# EasyEDA Pro project 10-10.eprj

# Schematic 原理图

## Sheets
1 主控MCU: Board Name: 驱动屏幕; Create Date: 2024-04-22; Page Name: 主控MCU; Project Name: 驱动圆形屏幕; Schematic Name: 原理图; Update Date: 2025-04-11; Company: 嘉立创EDA; Page Size: A3; Version: V1.0
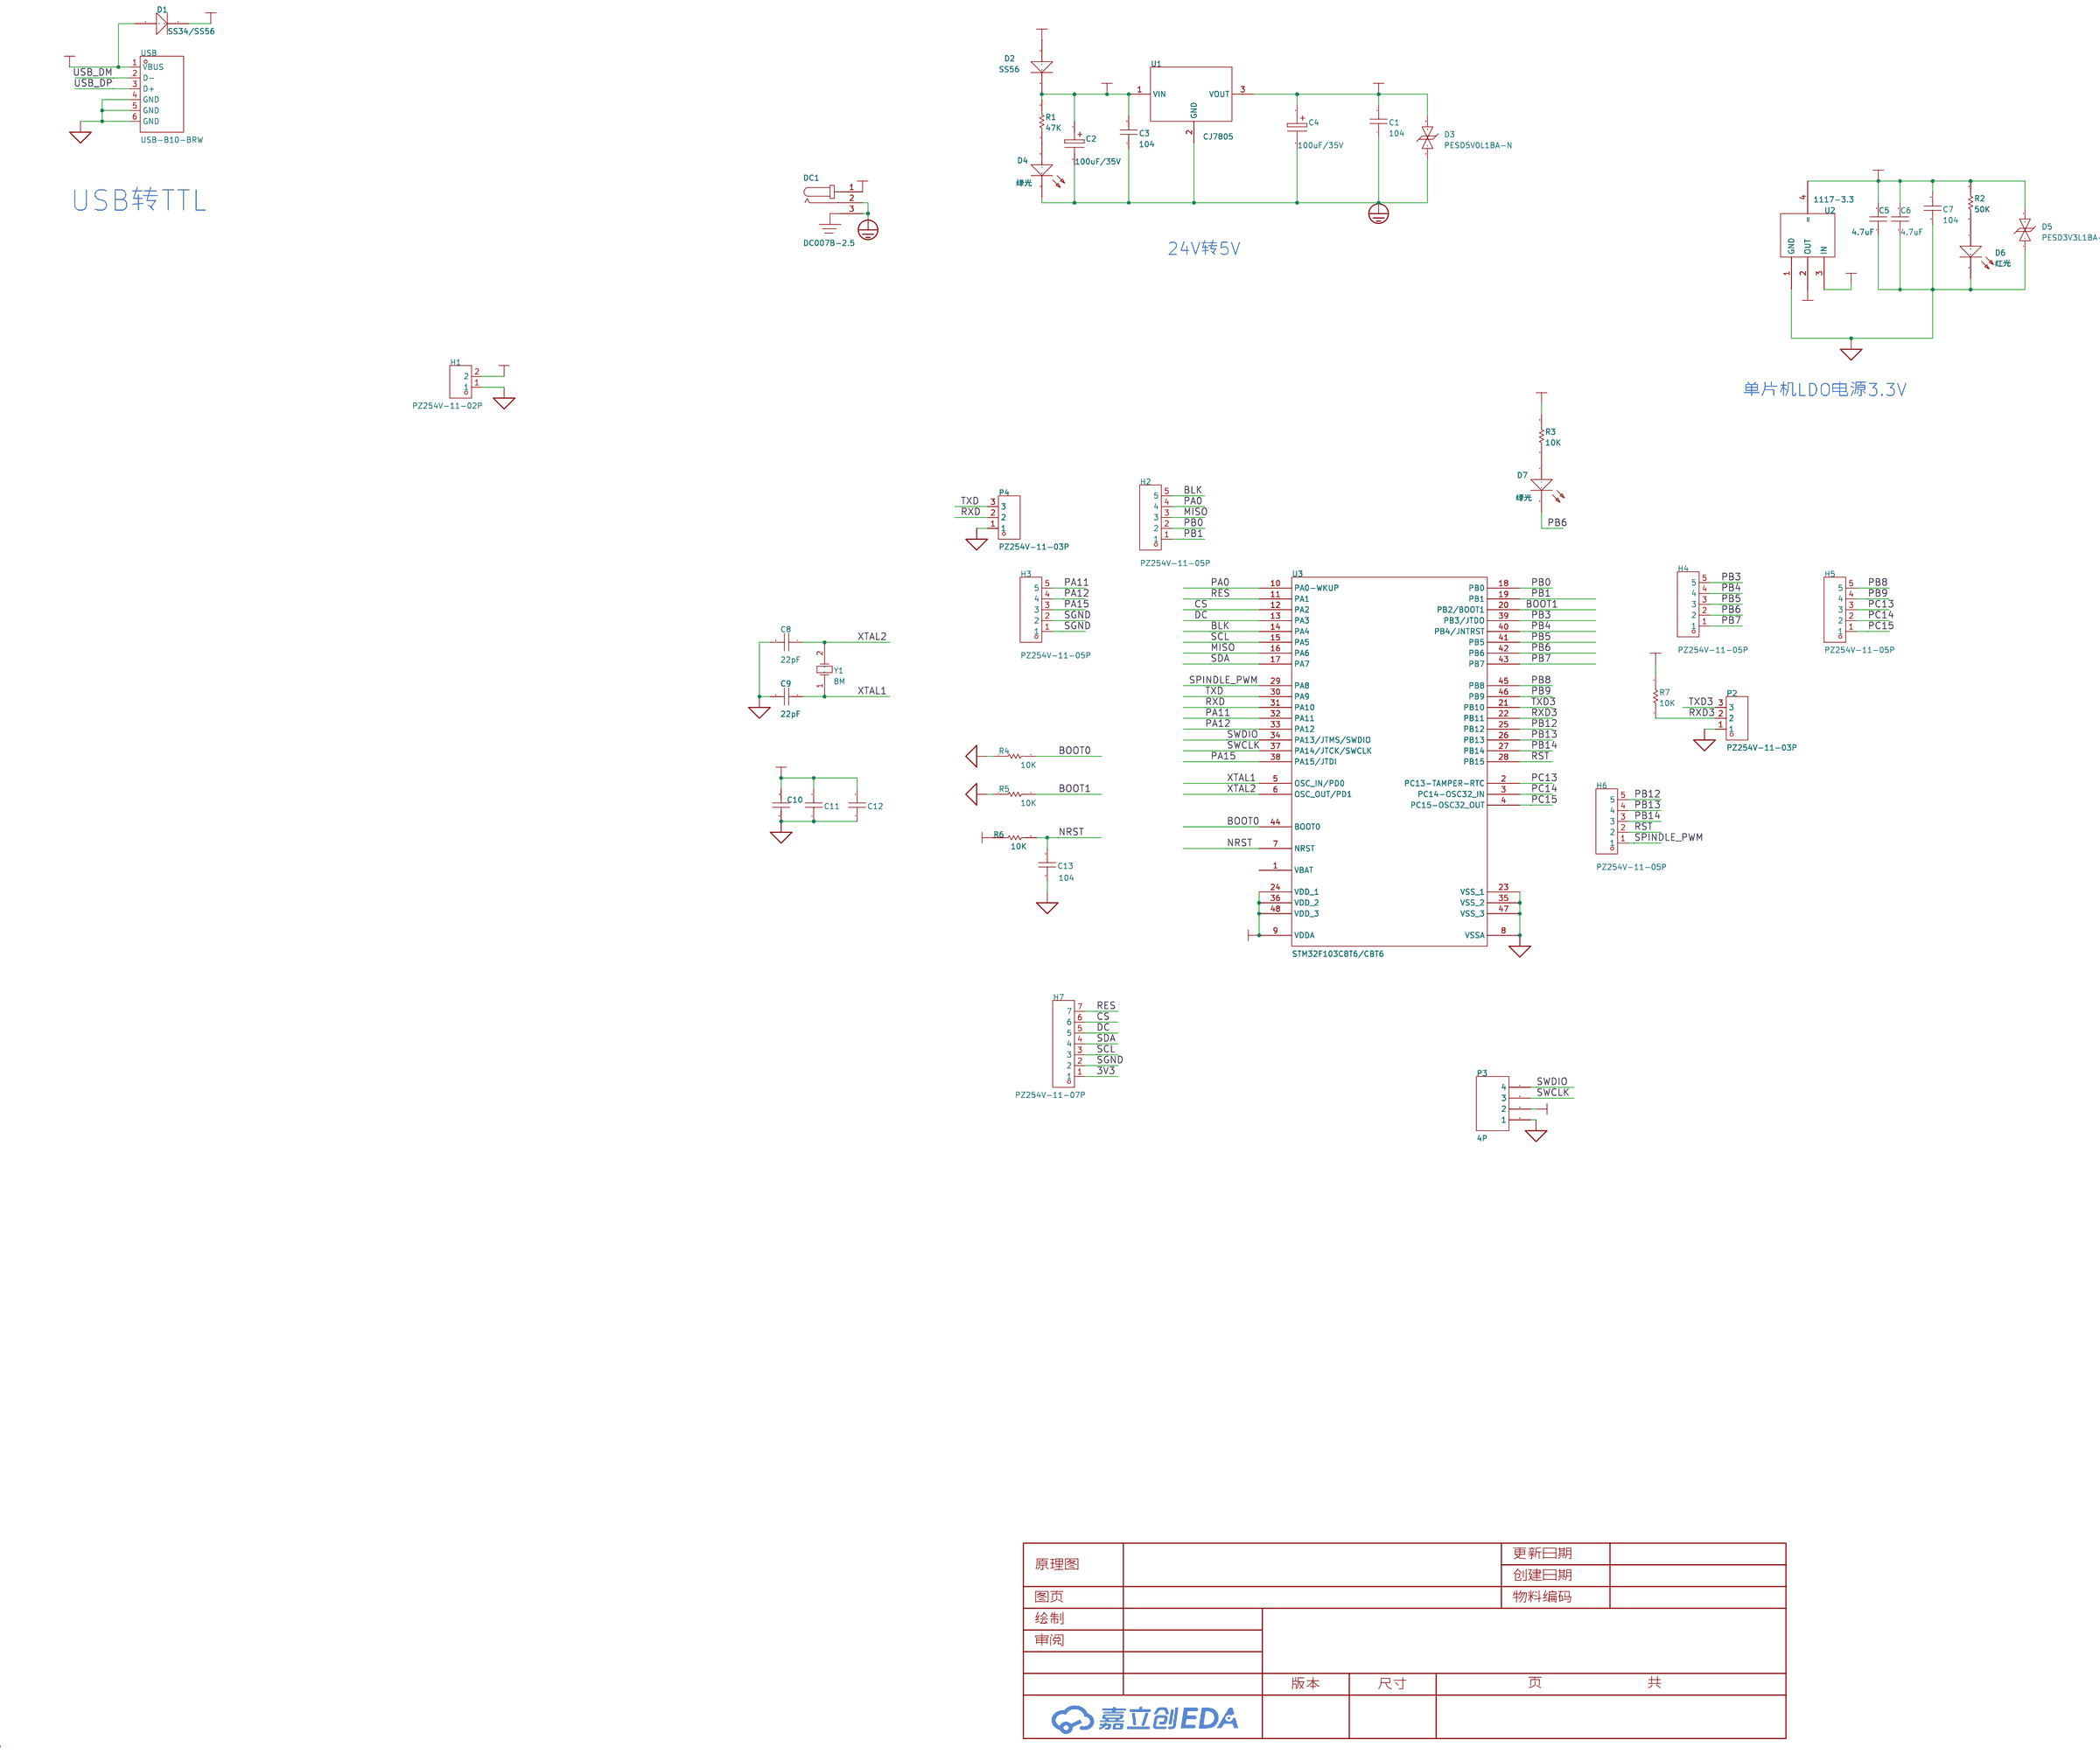
[diagram p0: 主控MCU]
2 电源及控制: Board Name: 转接隔离板; Create Date: 2024-12-30; Page Name: 电源及控制; Project Name: 延时继电器; Update Date: 2025-04-08
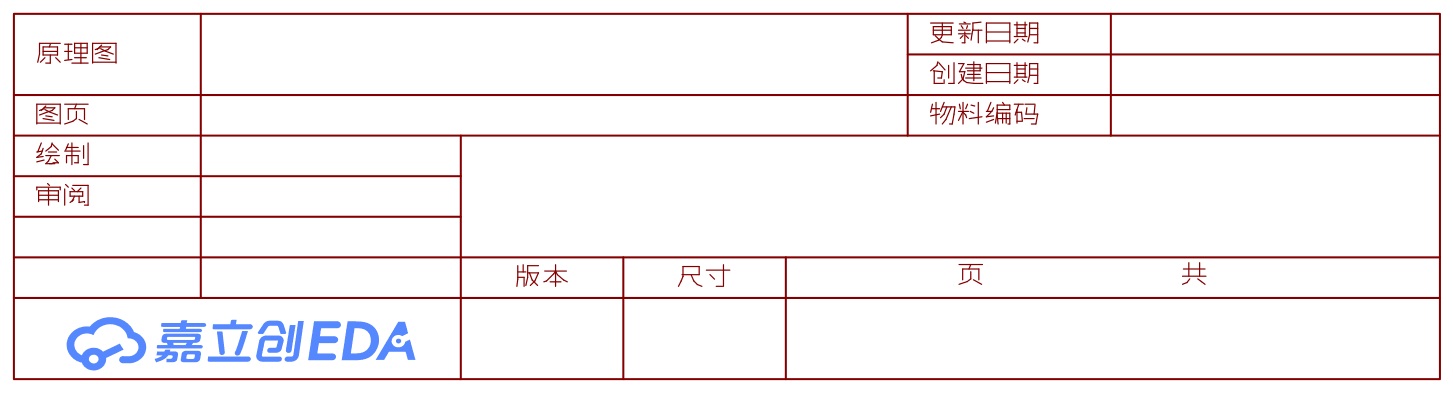
[diagram p1: 电源及控制]

## Parts
C1  104  [0603C]
C2  100uF/35V  [电解电容贴片6X6]
C3  104  [0603C]
C4  100uF/35V  [电解电容贴片6X6]
C5  4.7uF  [C1206]
C6  4.7uF  [C1206]
C7  104  [0603C]
C8  100pF  [0603C]
C9  100pF  [0603C]
C10  104  [0603C]
C11  104  [0603C]
C12  104  [0603C]
C13  104  [0603C]
D1  SS34/SS56  [SMA]
D2  SS56  [SMA]
D3  PESD5V0L1BA-N  [SOD-523_L1.2-W0.8-LS1.6-BI]
D4  绿光  [0603LED]
D5  PESD3V3L1BA-N  [SOD-523_L1.2-W0.8-LS1.6-BI]
D6  红光  [0603LED]
D7  绿光  [0603LED]
DC1  DC007B-2.5  [DC-IN-TH_HX-DC007B-2.5]
H1  PZ254V-11-02P  [HDR-TH_2P-P2.54-V-M]
H2  PZ254V-11-05P  [HDR-TH_5P-P2.54-V-M]
H3  PZ254V-11-05P  [HDR-TH_5P-P2.54-V-M]
H4  PZ254V-11-05P  [HDR-TH_5P-P2.54-V-M]
H5  PZ254V-11-05P  [HDR-TH_5P-P2.54-V-M]
H6  PZ254V-11-05P  [HDR-TH_5P-P2.54-V-M]
H7  PZ254V-11-07P  [HDR-TH_7P-P2.54-V-M]
P2  PZ254V-11-03P  [HDR1X3_CON]
P3  4P  [SIP4]
P4  PZ254V-11-03P  [HDR-TH_3P-P2.54-V-M]
R1  47K  [0603R]
R2  50K  [0603R]
R3  10K  [0603R]
R4  10K  [0603R]
R5  10K  [0603R]
R6  10K  [0603R]
R7  10K  [0603R]
U1  CJ7805  [TO-263-2]
U2  1117-3.3  [SOT-223]
U3  STM32F103C8T6/CBT6  [LQFP48]
USB  USB-B10-BRW  [USB-B-TH_USB-B12-BRW]
Y1  8M  [晶振贴片]

## Library data of the parts
C1 C3 C7 = 104: Capacitor (Semiconductor SIM Model); Published: 8-Jun-2000; LatestRevisionDate: 17-Jul-2002; LatestRevisionNote: Re-released for DXP Platform.; PackageReference: C1206; Publisher: Altium Limited; Origin Footprint 2: C1206; Origin Footprint 3: 0402; Origin Footprint 4: 1310[0504]; Origin Footprint 5: 1608[0603]; Origin Footprint 6: C1210; Origin Footprint 7: C0805; Origin Footprint 8: C1206; Origin Footprint 9: 0805; Origin Footprint 10: 0805L; Design Item ID: Cap Semi; Library Name: Miscellaneous Devices
C2 C4 = 100uF/35V: Origin Footprint 2: X47U; Origin Footprint 1: 电解电容贴片6x6; Design Item ID: ELECTRO1; Library Name: *
C5 C6 = 104: Design Item ID: CAP; Library Name: SCH--װ--
C8 C9 = 22pF: Capacitor (Semiconductor SIM Model); Published: 8-Jun-2000; LatestRevisionDate: 17-Jul-2002; LatestRevisionNote: Re-released for DXP Platform.; PackageReference: C1206; Publisher: Altium Limited; Origin Footprint 2: C1206; Origin Footprint 3: 0402; Origin Footprint 4: 1310[0504]; Origin Footprint 5: 1608[0603]; Origin Footprint 6: C1210; Origin Footprint 7: C0805; Origin Footprint 8: C1206; Origin Footprint 9: 0805; Origin Footprint 10: 0805L; Origin Footprint 11: 0805C; Design Item ID: Cap Semi; Library Name: Miscellaneous Devices
C10-C12 = 104: Origin Footprint 2: CAP; Origin Footprint 3: 0805C; Design Item ID: CAP; Library Name: SCH封装库
C13 = 104: Capacitor (Semiconductor SIM Model); Published: 8-Jun-2000; LatestRevisionDate: 17-Jul-2002; LatestRevisionNote: Re-released for DXP Platform.; PackageReference: C1206; Publisher: Altium Limited; Origin Footprint 2: C1206; Origin Footprint 3: 0402; Origin Footprint 4: 1310[0504]; Origin Footprint 5: 1608[0603]; Origin Footprint 6: C1210; Origin Footprint 7: C0805; Origin Footprint 8: C1206; Origin Footprint 9: 0805; Origin Footprint 10: 0805L; Origin Footprint 11: 0805C; Design Item ID: Cap Semi; Library Name: Miscellaneous Devices
D1 D2 = SS56: Design Item ID: 1N4148; Library Name: SCH封装库
D3 D5 = PESD5V0S1BBN: 极性:Bidirectional;反向关断电压（典型值）:5V (Max);击穿电压（最小值）:6V;箝位电压:15V;峰值脉冲电流（10/1000us）:5A (8/20us);; Supplier Part: C314264; Manufacturer: BORN伯恩半导体; Supplier Footprint: SOD-523; JLCPCB Part Class: Extended Part; Datasheet: https://atta.szlcsc.com/upload/public/pdf/source/20181015/C314264_F9AC5761AC2631DA841FBD1D9C6821E3.pdf; Supplier: LCSC; Polarity: Bidirectional; Voltage - Reverse Standoff (Typ): 5V (Max); Voltage - Breakdown (Min): 6V; Voltage - Clamping (Max) @ Ipp: 15V; Current - Peak Pulse (10/1000μs): 5A (8/20us)
D4 D7 = 绿光: Origin Footprint 2: LED(小); Design Item ID: LED; Library Name: SCH封装库
D6 = 红光: Origin Footprint 2: LED(小); Design Item ID: LED; Library Name: SCH封装库
DC1 = DC007B-2.5: LCSC Part Name: DC电源插座 内径:2.5mm 外径:7.7mm; Supplier Part: C17701685; Manufacturer: SHOU HAN(首韩); Supplier Footprint: 插件; JLCPCB Part Class: 扩展库; Datasheet: https://atta.szlcsc.com/upload/public/pdf/source/20230912/B85EC3863CDA4EDD9FBFF38F4F2C356A.pdf; Supplier: LCSC; Connector Type: DC电源插座; Mounting Type: 弯插; Inside Contact Diameter: 2.5mm; Outside Contact Diameter: 7.7mm; Current Rating: 5A; Voltage Rating (Max): 20V; Operating Temperature: -25℃~+70℃
H1 = PZ254V-11-02P: 插针结构:1x2P;间距:2.54mm;行距:-;圆针/方针:方针;安装类型:直插;排数:单排;总PIN位数:2P;额定电流:-;额定电压:-;配合针长度:6mm;塑高:2.5mm;端接针长度:3mm;触头材质:黄铜;触头镀层:-;工作温度范围:-40℃~+105℃;颜色:黑色;; LCSC Part Name: 间距:2.54mm 1x2P 直插 方针; Supplier Part: C492401; Manufacturer: XFCN(兴飞); Supplier Footprint: 插件,P=2.54mm; JLCPCB Part Class: 扩展库; Datasheet: https://atta.szlcsc.com/upload/public/pdf/source/20200309/C492401_A812433581A9B211A7FFA413ADDFF0E5.pdf; Supplier: LCSC; Pin Structure: 1x2P; Pitch: 2.54mm; Circluar Pins/Square Pins: 方针; Mounting Type: 直插; Number of Rows: 单排; Number of Pins: 2P; Length of Mating Pin: 6mm; Insulation Height: 2.5mm; Length of End Connection Pin: 3mm; Contact Material: 黄铜; Operating Temperature Range: -40℃~+105℃; Color: 黑色
H2-H6 = PZ254V-11-05P: LCSC Part Name: 2.54mm 1x5P 直插 方针; Supplier Part: C492404; Manufacturer: XFCN(兴飞); Supplier Footprint: 直插,P=2.54mm; JLCPCB Part Class: Extended Part; Datasheet: https://atta.szlcsc.com/upload/public/pdf/source/20200309/C492404_E51533260F8710EFF5D4617281164C1D.pdf; Supplier: LCSC; Pitch: 2.54mm; Number of Pins: 5; Number of Rows: 1; Pin Structure: 1x5P; Mounting Type: 直插; Circluar Pins/Square Pins: 方针; Length of Mating Pin: 6mm; Insulation Height: 2.5mm; Length of End Connection Pin: 3mm; Contact Material: 黄铜; Operating Temperature Range: -40℃~+105℃; Color: 黑色
H7 = PZ254V-11-07P: LCSC Part Name: 2.54mm 1x7P 直插 方针; Supplier Part: C492406; Manufacturer: XFCN(兴飞); Supplier Footprint: 直插,P=2.54mm; JLCPCB Part Class: Extended Part; Datasheet: https://atta.szlcsc.com/upload/public/pdf/source/20200309/C492406_654C533EE691117E22DD9F76C114C2D9.pdf; Supplier: LCSC; Pitch: 2.54mm; Number of Pins: 7; Number of Rows: 1; Pin Structure: 1x7P; Mounting Type: 直插; Circluar Pins/Square Pins: 方针; Length of Mating Pin: 6mm; Insulation Height: 2.5mm; Length of End Connection Pin: 3mm; Contact Material: 黄铜; Operating Temperature Range: -40℃~+105℃; Color: 黑色
P2 P4 = PZ254V-11-03P: 插针结构:1x3P;间距:2.54mm;行距:-;圆针/方针:方针;安装类型:直插;排数:单排;总PIN位数:3P;额定电流:3A;额定电压:250V;配合针长度:6mm;塑高:2.5mm;端接针长度:3mm;工作温度范围:-40℃~+105℃;颜色:黑色;; LCSC Part Name: 间距:2.54mm 1x3P 直插 方针; Supplier Part: C2937625; Manufacturer: XFCN(兴飞); Supplier Footprint: 插件,P=2.54mm; JLCPCB Part Class: 扩展库; Datasheet: https://atta.szlcsc.com/upload/public/pdf/source/20200309/C492402_8335C3D49C4E4C618838D59BB1D024C1.pdf; Supplier: LCSC; Pin Structure: 1x3P; Pitch: 2.54mm; Circluar Pins/Square Pins: 方针; Mounting Type: 直插; Number of Rows: 单排; Number of Pins: 3P; Current Rating (Max): 3A; Voltage Rating (Max): 250V; Length of Mating Pin: 6mm; Insulation Height: 2.5mm; Length of End Connection Pin: 3mm; Operating Temperature Range: -40℃~+105℃; Color: 黑色
P3 = 4P: Library Name: SCH--װ--
R1-R3 R7 = 1K: Resistor; Published: 8-Jun-2000; LatestRevisionDate: 17-Jul-2002; LatestRevisionNote: Re-released for DXP Platform.; PackageReference: AXIAL-0.3; Publisher: Altium Limited; Origin Footprint 2: AXIAL-0.3; Origin Footprint 3: R0805; Origin Footprint 4: 0805R; Design Item ID: RES; Library Name: SCH封装库
R4-R6 = 10K: Resistor; Published: 8-Jun-2000; LatestRevisionDate: 17-Jul-2002; LatestRevisionNote: Re-released for DXP Platform.; PackageReference: AXIAL-0.3; Publisher: Altium Limited; Origin Footprint 2: AXIAL-0.3; Origin Footprint 3: 0805R; Origin Footprint 4: 0805R; Design Item ID: RES; Library Name: SCH封装库
U1 = CJ7805: Design Item ID: 7805; Library Name: SCH封装库
U2 = 1117-3.3: Design Item ID: LM1117; Library Name: Party600
U3 = STM32F103C8T6/CBT6: STM32 ARM-based 32-bit MCU with 32 Kbytes Flash, 48-pin LQFP, Industrial Temperature; Published: *; DatasheetVersion: *; PackageVersion: *; PackageReference: *; Publisher: *; PackageDescription: *; ComponentLink1Description: *; ComponentLink1URL: *; ComponentLink2Description: *; ComponentLink2URL: *; Origin Footprint 2: LQFP48_L; Origin Footprint 3: LQFP48_M; Design Item ID: STM32F103C6T6; Library Name: ST Microcontroller 32-Bit STM32 SCH
USB = USB-B10-BRW: 连接器类型:Type-B;标准:USB 2.0;公母:母;端口数量:1;触点数量:4P;安装方式:弯插;额定电流 - 电源:1.5A;工作温度范围:-20℃~+70℃;焊接温度(最大值):260℃;; LCSC Part Name: Type-B母弯插; Supplier Part: C720549; Manufacturer: XUNPU(讯普); Supplier Footprint: 插件; JLCPCB Part Class: 扩展库; Datasheet: https://atta.szlcsc.com/upload/public/pdf/source/20200812/C720549_53E9294752E2933874870440E626C579.pdf; Supplier: LCSC; Connector Type: Type-B; Standard: USB2.0; Gender: 母; Number of Ports: 1; Number of Contacts: 4P; Mounting Style: 弯插; Current Rating - Power (Max): 1.5A; Operating Temperature Range: -20℃~+70℃; Soldering Temperature(Max): 260℃
Y1 = 8M: Crystal Oscillator; Published: 8-Jun-2000; LatestRevisionDate: 17-Jul-2002; LatestRevisionNote: Re-released for DXP Platform.; PackageReference: R38; Publisher: Altium Limited; Origin Footprint 2: R38; Origin Footprint 3: XTAL-49S; Design Item ID: XTAL; Library Name: Miscellaneous Devices

## Nets
3V3: C5.2 C6.2 C7.2 C10.2 C11.2 C12.2 D5.2 H7.1 P3.2 R2.1 R3.2 R6.1 R7.2 U2.2(OUT) U2.4(=) U3.9(VDDA) U3.24(VDD_1) U3.36(VDD_2) U3.48(VDD_3)
5V_VCC: C1.2 C4.1 D1.2 D3.2 H1.2 U1.3(VOUT) U2.3(IN)
24V: D2.1 DC1.1
SGND: C1.1 C2.2 C3.1 C4.2 C5.1 C6.1 C7.1 C8.2 C9.2 C10.1 C11.1 C12.1 C13.1 D3.1 D4.2 D5.1 D6.2 DC1.2 DC1.3 H1.1 H3.1 H3.2 H7.2 P2.1 P3.1 P4.1 R4.1 R5.1 U1.2(GND) U2.1(GND) U3.8(VSSA) U3.23(VSS_1) U3.35(VSS_2) U3.47(VSS_3) USB.4(GND) USB.5(GND) USB.6(GND)
VIN_24V: C2.1 C3.2 D2.2 R1.2 U1.1(VIN)
BLK: H2.5 U3.14(PA4)
BOOT0: R4.2 U3.44(BOOT0)
BOOT1: R5.2 U3.20(PB2/BOOT1)
CS: H7.6 U3.12(PA2)
DC: H7.5 U3.13(PA3)
MISO: H2.3 U3.16(PA6)
NRST: C13.2 R6.2 U3.7(NRST)
PA0: H2.4 U3.10(PA0-WKUP)
PA11: H3.5 U3.32(PA11)
PA12: H3.4 U3.33(PA12)
PA15: H3.3 U3.38(PA15/JTDI)
PB0: H2.2 U3.18(PB0)
PB1: H2.1 U3.19(PB1)
PB3: H4.5 U3.39(PB3/JTDO)
PB4: H4.4 U3.40(PB4/JNTRST)
PB5: H4.3 U3.41(PB5)
PB6: D7.2 H4.2 U3.42(PB6)
PB7: H4.1 U3.43(PB7)
PB8: H5.5 U3.45(PB8)
PB9: H5.4 U3.46(PB9)
PB12: H6.5 U3.25(PB12)
PB13: H6.4 U3.26(PB13)
PB14: H6.3 U3.27(PB14)
PC13: H5.3 U3.2(PC13-TAMPER-RTC)
PC14: H5.2 U3.3(PC14-OSC32_IN)
PC15: H5.1 U3.4(PC15-OSC32_OUT)
RES: H7.7 U3.11(PA1)
RST: H6.2 U3.28(PB15)
RXD: P4.2 U3.31(PA10)
RXD3: P2.2 R7.1 U3.22(PB11)
SCL: H7.3 U3.15(PA5)
SDA: H7.4 U3.17(PA7)
SPINDLE_PWM: H6.1 U3.29(PA8)
SWCLK: P3.3 U3.37(PA14/JTCK/SWCLK)
SWDIO: P3.4 U3.34(PA13/JTMS/SWDIO)
TXD: P4.3 U3.30(PA9)
TXD3: P2.3 U3.21(PB10)
USB_DM: USB.2(D-)
USB_DP: USB.3(D+)
VUSB: D1.1 USB.1(VBUS)
XTAL1: C9.1 U3.5(OSC_IN/PD0) Y1.1(OSC1)
XTAL2: C8.1 U3.6(OSC_OUT/PD1) Y1.2(OSC2)
$1N53807: D7.1 R3.1
$1N55881: D6.1 R2.2
$1N62733: D4.1 R1.1

Not connected (* = marked no-connect by the designer): U3 1(VBAT)

## Notes on the sheets
sheet 1
- USB转TTL
- 24V转5V
- 单片机LDO电源3.3V

# Board PCB
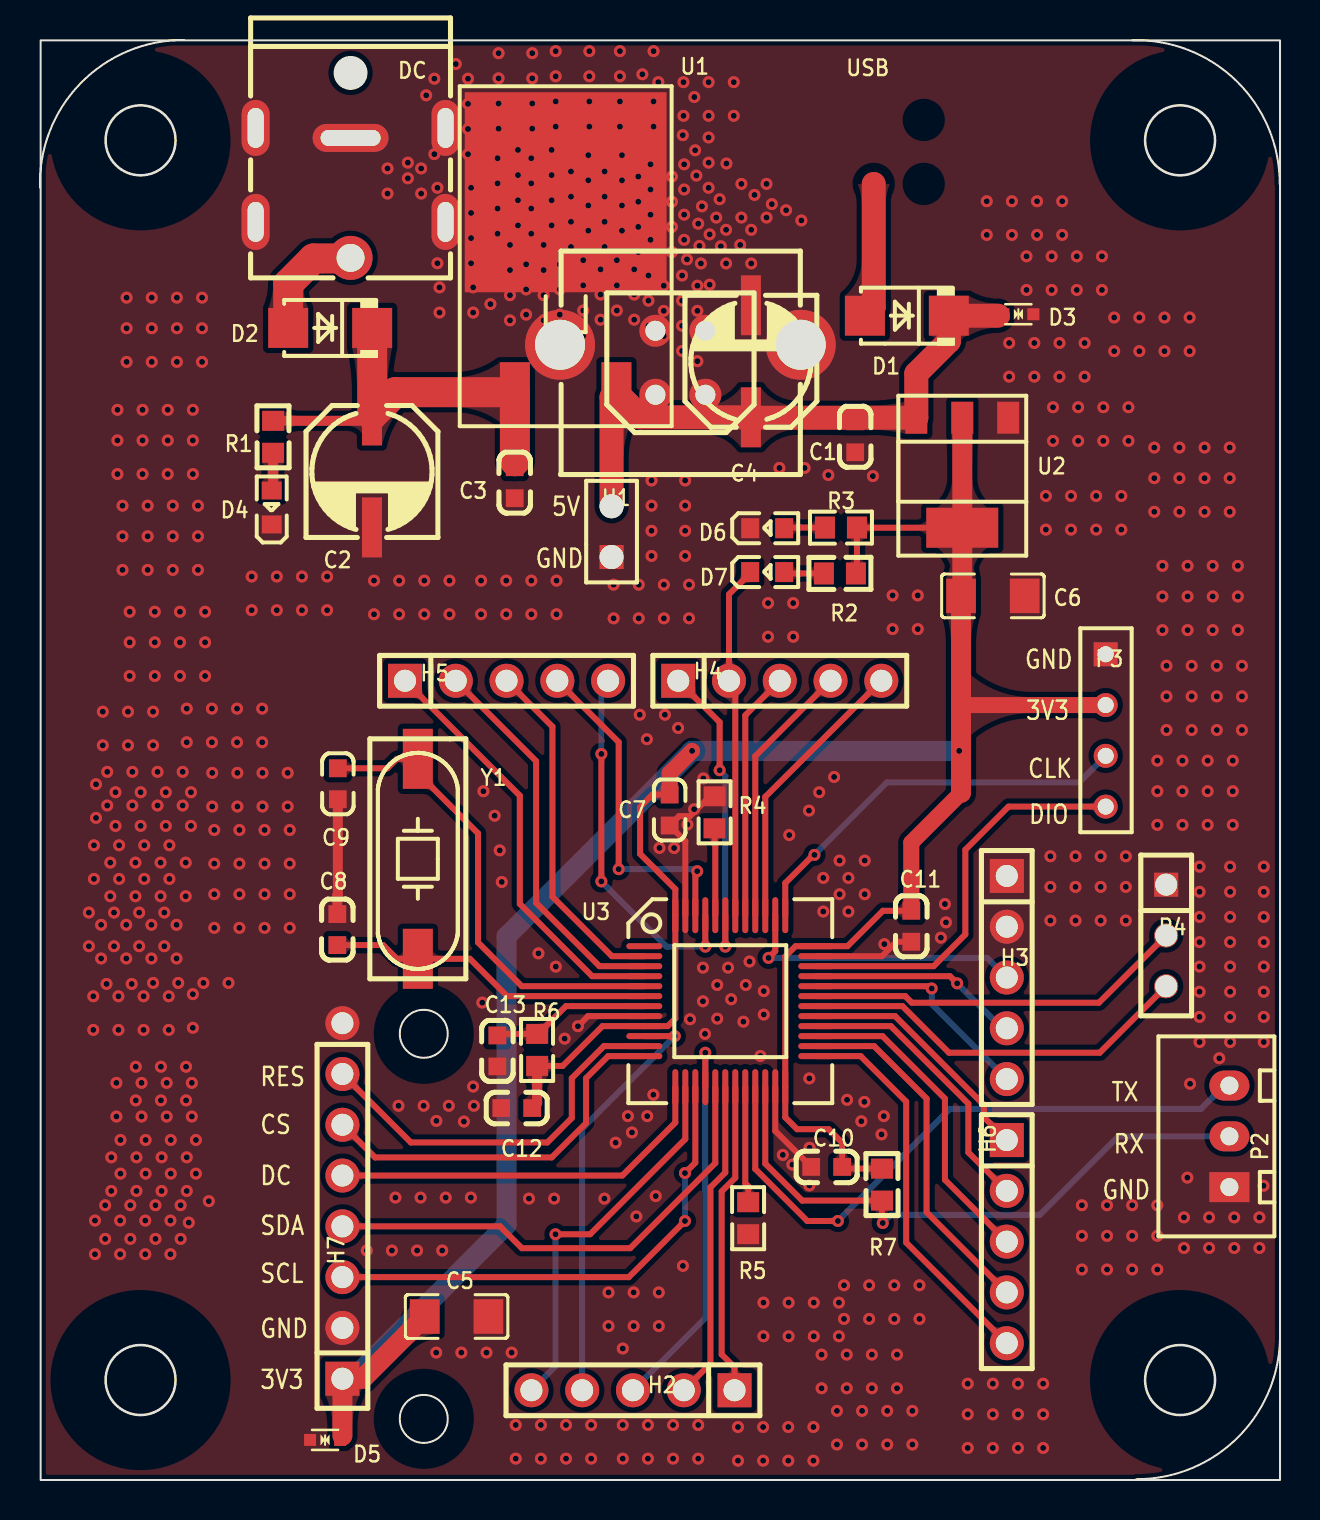
[diagram p2: board, top side]
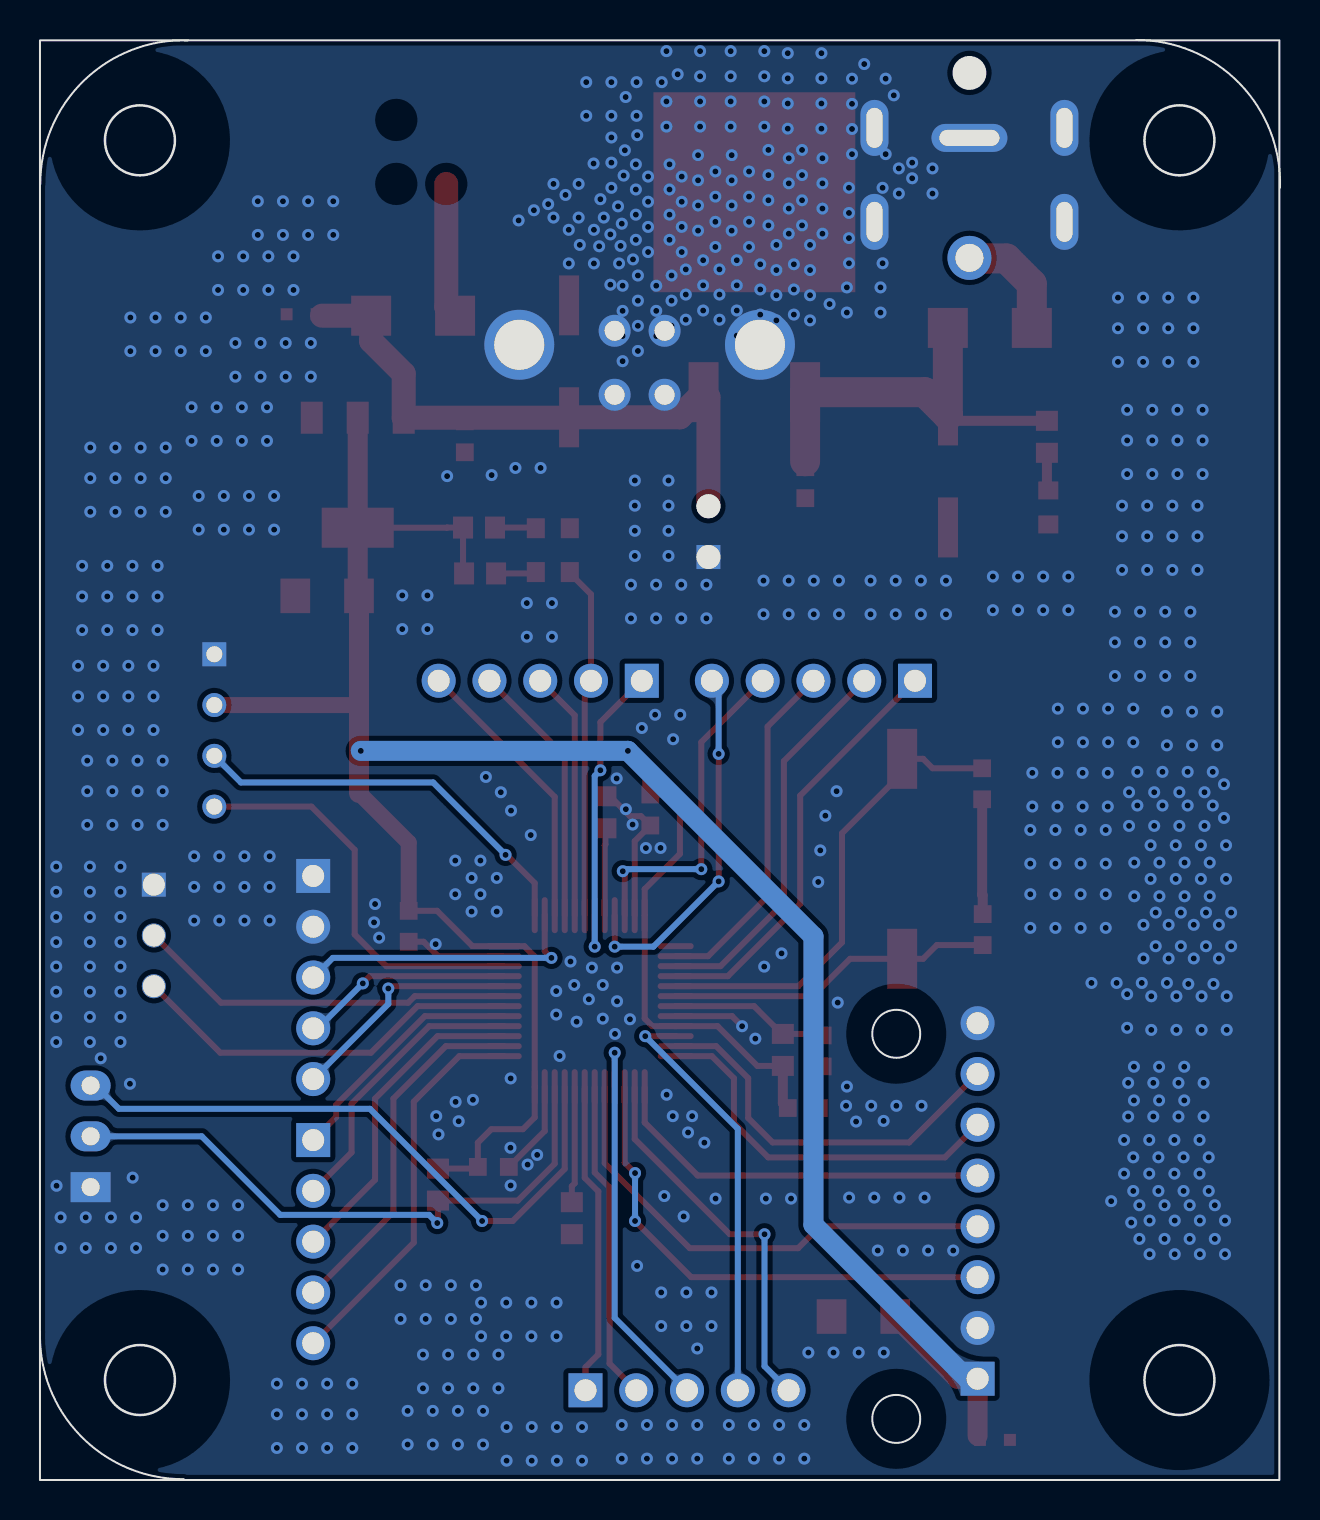
[diagram p3: board, bottom side, seen from below]

Outline 62.03 x 72.02 mm; copper layers: Top Layer, Bottom Layer. Coordinates in mm from the lower left corner of the outline.
Outline path: rectangle 0.03,72 62.03,0 ; circle c5.03,67 r1.75 ; circle c5.03,5 r1.75 ; circle c19.2,22.32 r1.2 ; circle c19.2,3.06 r1.2 ; circle c57.03,67 r1.75 ; circle c57.03,5 r1.75 ; 0,64.64 arc(2.03,69.85) 7.19,72.02 ; 54.64,72 arc(59.85,69.97) 62.02,64.81 ; 62.03,7.42 arc(60,2.21) 54.83,0.04
Stack: Top Layer 0.035mm / Dielectric1 1.51mm FR4 er 4.5 / Bottom Layer 0.035mm

## Design rules (mm)
template: 用户自定义配置
spacing Default (default): track to track 0.152, other pairs 0 to 0.152
track width Default (default): min 0.254, default 0.254, max 25.4
differential pair differentialPair (default): width min 0.127, default 0.254, max 2.54; gap min 0.152, default 0.152
via Default (default): diameter min 0.25, default 0.61, max 100.025; hole min 0.2, default 0.305, max 59.995

## Placement (name value [footprint] x y rotation side)
C1  104  [0603C]  40.78 52.17 90 top
C2  100uF/35V  [电解电容贴片6X6]  16.61 50.44 270 top
C3  104  [0603C]  23.75 49.88 90 top
C4  100uF/35V  [电解电容贴片6X6]  35.56 55.95 90 top
C5  4.7uF  [C1206]  20.84 8.18 180 top
C6  4.7uF  [C1206]  47.67 44.22 180 top
C7  104  [0603C]  31.5 33.51 90 top
C8  100pF  [0603C]  14.87 27.53 90 top
C9  100pF  [0603C]  14.9 34.82 270 top
C10  104  [0603C]  39.35 15.66 0 top
C11  104  [0603C]  43.59 27.69 90 top
C12  104  [0603C]  23.85 18.6 0 top
C13  104  [0603C]  22.88 21.46 90 top
D1  SS34/SS56  [SMA]  43.37 58.23 180 top
D2  SS56  [SMA]  14.52 57.62 180 top
D3  PESD5V0L1BA-N  [SOD-523_L1.2-W0.8-LS1.6-BI]  48.94 58.3 180 top
D4  绿光  [0603LED]  11.61 48.6 270 top
D5  PESD3V3L1BA-N  [SOD-523_L1.2-W0.8-LS1.6-BI]  14.26 2.01 0 top
D6  红光  [0603LED]  36.34 47.58 180 top
D7  绿光  [0603LED]  36.34 45.39 180 top
DC  DC007B-2.5  [DC-IN-TH_HX-DC007B-2.5]  15.54 64.37 270 top
H1  PZ254V-11-02P  [HDR-TH_2P-P2.54-V-M]  28.59 47.43 90 top
H2  PZ254V-11-05P  [HDR-TH_5P-P2.54-V-M]  29.66 4.49 180 top
H3  PZ254V-11-05P  [HDR-TH_5P-P2.54-V-M]  48.36 25.13 270 top
H4  PZ254V-11-05P  [HDR-TH_5P-P2.54-V-M]  37.01 39.97 0 top
H5  PZ254V-11-05P  [HDR-TH_5P-P2.54-V-M]  23.34 39.97 0 top
H6  PZ254V-11-05P  [HDR-TH_5P-P2.54-V-M]  48.36 11.92 270 top
H7  PZ254V-11-07P  [HDR-TH_7P-P2.54-V-M]  15.13 12.69 90 top
NOREF  -  [Pad_e686]  15.13 22.85 0 top
P2  PZ254V-11-03P  [HDR1X3_CON]  59.5 17.19 90 top
P3  4P  [SIP4]  53.31 41.3 270 top
P4  PZ254V-11-03P  [HDR-TH_3P-P2.54-V-M]  56.34 27.23 270 top
R1  47K  [0603R]  11.66 52.17 90 top
R2  50K  [0603R]  40.07 47.63 180 top
R3  10K  [0603R]  40.02 45.34 0 top
R4  10K  [0603R]  33.74 33.39 270 top
R5  10K  [0603R]  35.43 13.09 90 top
R6  10K  [0603R]  24.87 21.51 90 top
R7  10K  [0603R]  42.12 14.77 90 top
U1  CJ7805  [TO-263-2]  26.3 54.4 270 top
U2  1117-3.3  [SOT-223]  46.14 50.43 180 top
U3  STM32F103C8T6/CBT6  [LQFP48]  34.53 23.95 0 top
USB  USB-B10-BRW  [USB-B-TH_USB-B12-BRW]  42.96 66.54 180 top
Y1  8M  [晶振贴片]  18.9 31.07 270 top

## Footprints (pads in the part's own frame, mm; a bottom-side part is the same pattern mirrored in y, then rotated)
0603C
  rect 0.889x0.889 smd: 1(-0.774,0) 2(0.774,0)
0603LED
  rect 0.9x1 smd: 1(-0.884,-0.017) 2(0.816,-0.017)
0603R
  rect 1x1.1 smd: 1(-0.8,0) 2(0.8,0)
C1206
  rect 1.485x1.728 smd: 1(-1.593,0) 2(1.593,0)
DC-IN-TH_HX-DC007B-2.5
  round 2.2 hole 1.4: 1(3.25,0)
  oval 1.4x3.8 hole 0.8x3: 2(-2.75,0)
  oval 2.8x1.4 hole 2x0.8: 3(-3.25,4.75) 3(-3.25,-4.75) 3(1.45,4.75) 3(1.45,-4.75)
HDR1X3_CON
  rect 1.5x2 hole 0.9: 1(-2.54,0)
  oval 1.5x2 hole 0.9: 2(0,0) 3(2.54,0)
HDR-TH_2P-P2.54-V-M
  rect 1.2x1.2 hole 1.2x0.8: 1(-1.27,0)
  round 1.2 hole 1.2x0.8: 2(1.27,0)
HDR-TH_3P-P2.54-V-M
  rect 1.2x1.2 hole 1.1x0.8: 1(-2.54,0)
  round 1.2 hole 1.1x0.8: 2(0,0) 3(2.54,0)
HDR-TH_5P-P2.54-V-M
  rect 1.7x1.7 hole 1.1: 1(-5.08,0)
  round 1.7 hole 1.1: 2(-2.54,0) 3(0,0) 4(2.54,0) 5(5.08,0)
HDR-TH_7P-P2.54-V-M
  rect 1.7x1.7 hole 1.1: 1(-7.62,0)
  round 1.7 hole 1.1: 2(-5.08,0) 3(-2.54,0) 4(0,0) 5(2.54,0) 6(5.08,0) 7(7.62,0)
LQFP48
  oval 1.8x0.3 smd: 1(-4.3,2.75) 2(-4.3,2.25) 3(-4.3,1.75) 4(-4.3,1.25) 5(-4.3,0.75) 6(-4.3,0.25) 7(-4.3,-0.25) 8(-4.3,-0.75) 9(-4.3,-1.25) 10(-4.3,-1.75) 11(-4.3,-2.25) 12(-4.3,-2.75) 25(4.3,-2.75) 26(4.3,-2.25) 27(4.3,-1.75) 28(4.3,-1.25) 29(4.3,-0.75) 30(4.3,-0.25) 31(4.3,0.25) 32(4.3,0.75) 33(4.3,1.25) 34(4.3,1.75) 35(4.3,2.25) 36(4.3,2.75)
  oval 0.3x1.8 smd: 13(-2.75,-4.3) 14(-2.25,-4.3) 15(-1.75,-4.3) 16(-1.25,-4.3) 17(-0.75,-4.3) 18(-0.25,-4.3) 19(0.25,-4.3) 20(0.75,-4.3) 21(1.25,-4.3) 22(1.75,-4.3) 23(2.25,-4.3) 24(2.75,-4.3) 37(2.75,4.3) 38(2.25,4.3) 39(1.75,4.3) 40(1.25,4.3) 41(0.75,4.3) 42(0.25,4.3) 43(-0.25,4.3) 44(-0.75,4.3) 45(-1.25,4.3) 46(-1.75,4.3) 47(-2.25,4.3) 48(-2.75,4.3)
Pad_e686
  round 1.7 hole 1.1: 1(0,0)
SIP4
  rect 1.2x1.2 hole 0.8: 1(0,0)
  round 1.2 hole 0.8: 2(2.54,0) 3(5.08,0) 4(7.62,0)
SMA
  rect 2x2 smd: 1(2.1,0) 2(-2.1,0)
SOD-523_L1.2-W0.8-LS1.6-BI
  rect 0.6x0.6 smd: 1(-0.75,0) 2(0.75,0)
SOT-223
  rect 1.1x1.6 smd: 1(-2.3,-2.7) 2(0,-2.7) 3(2.3,-2.7)
  rect 3.6x2 smd: 4(0,2.8)
TO-263-2
  rect 3x1.5 smd: 1(0,-2.54) 3(0,2.54)
  rect 10x10.1 smd: 2(-10,0)
USB-B-TH_USB-B12-BRW
  round 1.6 hole 1: 1(12.172,12.268) 2(9.672,12.268) 3(9.672,9.068) 4(12.172,9.068)
  round 3.5 hole 2.5: 5(4.902,9.768) 6(16.942,9.768)
晶振贴片
  rect 3x1.5 smd: 1(-5,0) 2(5,0)
电解电容贴片6X6
  rect 3x1 smd: 1(-2.8,0) 2(2.8,0)

## Nets
As in the schematic, except:
24V: D2.1 DC.1
SGND: C1.1 C2.2 C3.1 C4.2 C5.1 C6.1 C7.1 C8.2 C9.2 C10.1 C11.1 C12.1 C13.1 D3.1 D4.2 D5.1 D6.2 DC.2 DC.3 H1.1 H3.1 H3.2 H7.2 NOREF.1 P2.1 P3.1 P4.1 R4.1 R5.1 U1.2 U2.1 U3.8 U3.23 U3.35 U3.47 USB.4 USB.5 USB.6

Pads without a net: U3 1

## Via types
v1: diameter 0.6, hole 0.3, Top Layer to Bottom Layer, 767 vias

## Routing (per net, layer and track width the routed paths; a pad name or vN(x,y) marks a point on that pad's centre or on a via; arc(x,y) is an arc through that point)
3V3: length 148.8
  Top Layer w0.3: C11.2 42.17,28.47 40.4,26.7 38.88,26.7 ; R6.1 26.15,20.71 28.14,22.7 U3.9 31.4,22.7 31.78,23.08 U3.48 31.78,29.55 30.02,31.31 30.02,33.66 30.64,34.28 C7.2 ; U2.4 41.67,47.63 41.67,47.63 R2.1 40.87,45.39 R3.2 ; R7.2 40.21,15.57 C10.2 40.13,16.87 39.45,17.54 37.87,17.54 37.28,18.14 U3.24 37.28,26.18 37.8,26.7 U3.36
  Top Layer w0.5: C12.2 24.87,18.85 R6.1
  Top Layer w0.8: C7.2 31.5,35.34 v1(32.62,36.47) ; 46.07,38.89 46.21,38.76 P3.2 ; C11.2 43.59,31.88 46.07,34.36
  Top Layer w1: C5.2 16.14,5.07 H7.1 15.13,2.21 ; 46.07,34.36 C6.2 46.14,44.28 U2.4 U2.2
  Bottom Layer w1: v1(45.98,36.47) v1(32.62,36.47) 23.34,27.18 23.34,12.77 15.64,5.07 H7.1
5V_VCC: length 29.6
  Top Layer w1.2: H1.2 28.59,54.16 U1.3 29.66,53.58 29.66,53.5 30.02,53.15 C4.1 35.58,53.13 U2.3 43.84,55.33 45.47,56.96 D1.2 47.92,58.23
24V: length 5.9
  Top Layer w1.5: DC.1 15.51,61.09 13.69,61.09 12.42,59.82 D2.1
SGND: length 26.7
  Top Layer w0.3: R4.1 33.51,34.19 32.52,33.2 31.97,33.2 C7.1 32.28,31.95 U3.47 ; 38.88,26.2 42.12,26.2 42.84,26.92 43.59,26.92 ; U3.8 27.41,23.2 v1(26.91,22.7) ; C10.1 36.78,17.45 U3.23
  Top Layer w0.5: C9.2 14.9,29.27 14.87,29.25 C8.2
  vias: v1(2.45,28.38) v1(2.45,26.7) v1(2.7,31.74) v1(2.7,30.06) v1(2.67,24.19) v1(2.67,22.51) v1(2.8,34.8) v1(2.8,33.11) v1(2.75,12.98) v1(2.75,11.29) v1(3.06,27.77) v1(3.06,26.08) v1(3.14,38.43) v1(3.14,36.74) v1(3.26,13.74) v1(3.26,12.06) v1(3.36,35.42) v1(3.36,33.73) v1(3.33,24.81) v1(3.52,30.88) v1(3.52,29.19) v1(3.57,16.14) v1(3.57,14.46) v1(3.7,28.38) v1(3.7,26.7) v1(3.78,34.4) v1(3.78,32.71) v1(3.82,19.86) v1(3.82,18.18) v1(3.87,53.52) v1(3.87,51.99) v1(3.87,50.31) v1(3.92,24.19) v1(3.92,22.51) v1(3.96,31.74) v1(3.96,30.06) v1(4.01,12.98) v1(4.01,11.29) v1(4.03,17.01) v1(4.03,15.32) v1(4.13,48.73) v1(4.13,47.2) v1(4.13,45.52) v1(4.31,27.77) v1(4.31,26.08) v1(4.33,59.13) v1(4.33,57.6) v1(4.33,55.92) v1(4.4,38.43) v1(4.4,36.74) v1(4.48,43.42) v1(4.48,41.89) v1(4.48,40.21) v1(4.52,13.74) v1(4.52,12.06) v1(4.62,35.42) v1(4.62,33.73) v1(4.59,24.81) v1(4.77,30.88) v1(4.77,29.19) v1(4.79,20.67) v1(4.79,18.99) v1(4.83,16.14) v1(4.83,14.46) v1(4.96,28.38) v1(4.96,26.7) v1(5.04,34.4) v1(5.04,32.71) v1(5.08,19.86) v1(5.08,18.18) v1(5.13,53.52) v1(5.13,51.99) v1(5.13,50.31) v1(5.22,31.74) v1(5.22,30.06) v1(5.18,24.19) v1(5.18,22.51) v1(5.28,17.01) v1(5.28,15.32) v1(5.27,12.98) v1(5.27,11.29) v1(5.39,48.73) v1(5.39,47.2) v1(5.39,45.52) v1(5.59,59.13) v1(5.59,57.6) v1(5.59,55.92) v1(5.57,27.77) v1(5.57,26.08) v1(5.66,38.43) v1(5.66,36.74) v1(5.66,24.86) v1(5.74,43.42) v1(5.74,41.89) v1(5.74,40.21) v1(5.78,13.74) v1(5.78,12.06) v1(5.88,35.42) v1(5.88,33.73) v1(6.03,30.88) v1(6.03,29.19) v1(6.05,20.67) v1(6.05,18.99) v1(6.08,16.14) v1(6.08,14.46) v1(6.22,28.38) v1(6.22,26.7) v1(6.29,34.4) v1(6.29,32.71) v1(6.39,53.52) v1(6.39,51.99) v1(6.39,50.31) v1(6.34,19.86) v1(6.34,18.18) v1(6.47,31.74) v1(6.47,30.06) v1(6.44,24.19) v1(6.44,22.51) v1(6.53,12.98) v1(6.53,11.29) v1(6.54,17.01) v1(6.54,15.32) v1(6.64,48.73) v1(6.64,47.2) v1(6.64,45.52) v1(6.85,59.13) v1(6.85,57.6) v1(6.85,55.92) v1(6.83,27.77) v1(6.83,26.08) v1(6.92,24.86) v1(7,43.42) v1(7,41.89) v1(7,40.21) v1(7.03,13.74) v1(7.03,12.06) v1(7.14,35.42) v1(7.14,33.73) v1(7.29,30.88) v1(7.29,29.19) v1(7.31,20.67) v1(7.31,18.99) v1(7.34,38.58) v1(7.34,36.9) v1(7.34,16.14) v1(7.34,14.46) v1(7.44,12.87) v1(7.55,34.4) v1(7.55,32.71) v1(7.6,19.86) v1(7.6,18.18) v1(7.65,53.52) v1(7.65,51.99) v1(7.65,50.31) v1(7.65,24.3) v1(7.65,22.62) v1(7.8,17.01) v1(7.8,15.32) v1(7.9,48.73) v1(7.9,47.2) v1(7.9,45.52) v1(8.11,59.13) v1(8.11,57.6) v1(8.11,55.92) v1(8.17,24.86) v1(8.26,43.42) v1(8.26,41.89) v1(8.26,40.21) v1(8.45,13.95) v1(8.6,38.58) v1(8.6,36.9) v1(8.62,35.37) v1(8.62,33.68) v1(8.72,32.51) v1(8.72,30.83) v1(8.72,29.3) v1(8.72,27.61) v1(9.43,24.86) v1(9.86,38.58) v1(9.86,36.9) v1(9.87,35.37) v1(9.87,33.68) v1(9.98,32.51) v1(9.98,30.83) v1(9.98,29.3) v1(9.98,27.61) v1(10.59,45.18) v1(10.59,43.5) v1(11.12,38.58) v1(11.12,36.9) v1(11.13,35.37) v1(11.13,33.68) v1(11.23,32.51) v1(11.23,30.83) v1(11.23,29.3) v1(11.23,27.61) v1(11.85,45.18) v1(11.85,43.5) v1(12.39,35.37) v1(12.39,33.68) v1(12.49,32.51) v1(12.49,30.83) v1(12.49,29.3) v1(12.49,27.61) v1(13.11,45.18) v1(13.11,43.5) v1(14.36,45.18) v1(14.36,43.5) v1(16.35,11.48) v1(16.71,44.98) v1(16.71,43.3) v1(17.38,65.6) v1(17.38,64.34) v1(17.61,11.48) v1(17.78,14.13) v1(17.97,44.98) v1(17.97,43.3) v1(17.93,18.72) v1(18.4,65.88) v1(18.4,65.1) v1(18.86,11.48) v1(19.07,65.6) v1(19.07,64.34) v1(19.04,14.13) v1(19.23,44.98) v1(19.23,43.3) v1(19.19,18.72) v1(19.32,69.25) v1(19.73,70.08) v1(19.73,66.31) v1(19.82,6.37) v1(19.88,64.63) v1(19.88,60.85) v1(19.83,17.96) v1(19.99,59.64) v1(19.99,58.39) v1(20.12,11.48) v1(20.3,14.13) v1(20.48,44.98) v1(20.48,43.3) v1(20.45,18.72) v1(20.8,70.81) v1(21.08,6.37) v1(21.21,17.93) v1(21.41,70.08) v1(21.41,68.83) v1(21.41,67.57) v1(21.41,66.31) v1(21.56,64.63) v1(21.56,63.37) v1(21.56,62.11) v1(21.56,60.85) v1(21.55,14.13) v1(21.67,59.64) v1(21.67,58.39) v1(21.67,19.68) v1(21.71,18.72) v1(22.06,44.98) v1(22.06,43.3) v1(22.12,23.88) v1(22.18,34.45) v1(22.34,6.37) v1(22.53,58.81) v1(22.74,33.22) v1(22.89,66.11) v1(22.89,64.85) v1(22.89,63.59) v1(22.89,62.33) v1(22.94,71.36) v1(22.94,70.1) v1(22.94,68.84) v1(22.94,67.58) v1(23,31.49) v1(23.1,29.91) v1(23.32,44.98) v1(23.32,43.3) v1(23.51,61.77) v1(23.51,60.51) v1(23.51,59.25) v1(23.51,58) v1(23.59,6.37) v1(23.8,2.75) v1(23.8,1.07) v1(23.91,66.52) v1(23.91,65.26) v1(23.91,64) v1(23.91,62.75) v1(24.32,60.8) v1(24.32,59.54) v1(24.32,58.28) v1(24.46,14.07) v1(24.62,71.36) v1(24.62,70.1) v1(24.62,68.84) v1(24.62,67.58) v1(24.57,66.11) v1(24.57,64.85) v1(24.57,63.59) v1(24.57,62.33) v1(24.58,44.98) v1(24.58,43.3) v1(24.94,26.34) v1(25.06,2.75) v1(25.06,1.07) v1(25.19,61.77) v1(25.19,60.51) v1(25.19,59.25) v1(25.19,58) v1(25.59,66.52) v1(25.59,65.26) v1(25.59,64) v1(25.59,62.75) v1(25.72,14.07) v1(25.8,71.46) v1(25.8,70.2) v1(25.8,68.94) v1(25.8,67.69) v1(25.8,25.68) v1(25.84,44.98) v1(25.84,43.3) v1(26,60.8) v1(26,59.54) v1(26,58.28) v1(26.25,22.07) v1(26.31,2.75) v1(26.31,1.07) v1(26.56,65.44) v1(26.56,64.18) v1(26.56,62.93) v1(26.56,61.67) v1(27.17,61) v1(27.17,59.75) v1(27.17,58.49) v1(27.17,57.23) v1(27.48,71.46) v1(27.48,70.2) v1(27.48,68.94) v1(27.48,67.69) v1(27.43,66.26) v1(27.43,65) v1(27.43,63.74) v1(27.43,62.48) v1(27.57,2.75) v1(27.57,1.07) v1(28.04,60.55) v1(28.04,59.29) v1(28.04,58.03) v1(28.24,65.44) v1(28.24,64.18) v1(28.24,62.93) v1(28.24,61.67) v1(28.23,14.07) v1(28.44,9.38) v1(28.44,7.7) v1(28.69,44.78) v1(28.69,43.09) v1(28.8,16.87) v1(28.86,61) v1(28.86,59.75) v1(28.86,58.49) v1(29.01,71.46) v1(29.01,70.2) v1(29.01,68.94) v1(29.01,67.69) v1(29.11,66.26) v1(29.11,65) v1(29.11,63.74) v1(29.11,62.48) v1(29.15,6.58) v1(29.15,2.75) v1(29.15,1.07) v1(29.41,18.2) v1(29.61,17.38) v1(29.72,60.55) v1(29.72,59.29) v1(29.72,58.03) v1(29.7,9.38) v1(29.7,7.7) v1(29.83,13.18) v1(29.93,65.19) v1(29.93,63.93) v1(29.93,62.67) v1(29.93,61.41) v1(29.95,44.78) v1(29.95,43.09) v1(30,38.27) v1(30.13,70.3) v1(30.36,37.05) v1(30.38,18.2) v1(30.41,2.75) v1(30.41,1.07) v1(30.44,60.24) v1(30.44,58.98) v1(30.44,57.72) v1(30.54,65.8) v1(30.54,64.54) v1(30.54,63.28) v1(30.54,62.02) v1(30.59,49.99) v1(30.59,48.73) v1(30.59,47.47) v1(30.59,46.21) v1(30.69,71.46) v1(30.69,68.94) v1(30.69,67.69) v1(30.68,19.27) v1(30.8,14.2) v1(30.93,69.91) v1(30.99,31.61) v1(30.95,9.38) v1(30.95,7.7) v1(31.2,59.73) v1(31.2,58.47) v1(31.2,57.21) v1(31.21,44.78) v1(31.21,43.09) v1(31.26,38.27) v1(31.61,65.19) v1(31.61,63.93) v1(31.61,62.67) v1(31.61,61.41) v1(31.72,31.61) v1(31.67,2.75) v1(31.67,1.07) v1(31.92,37.61) v1(32.12,60.24) v1(32.12,58.98) v1(32.12,57.72) v1(32.12,56.47) v1(32.19,69.91) v1(32.19,68.23) v1(32.16,67.26) v1(32.22,65.8) v1(32.22,64.54) v1(32.22,63.28) v1(32.22,62.02) v1(32.16,10.71) v1(32.27,49.99) v1(32.27,48.73) v1(32.27,47.47) v1(32.27,46.21) v1(32.37,61.05) v1(32.39,32.78) v1(32.47,44.78) v1(32.47,43.09) v1(32.52,23.04) v1(32.72,33.55) v1(32.73,69.17) v1(32.77,66.5) v1(32.83,65.24) v1(32.89,59.73) v1(32.89,58.47) v1(32.89,57.21) v1(32.89,55.96) v1(32.93,62.83) v1(32.99,61.72) v1(32.93,2.75) v1(32.93,1.07) v1(33.11,63.7) v1(33.06,60.84) v1(33.18,35.09) v1(33.16,25.62) v1(33.16,23.94) v1(33.27,22.31) v1(33.45,69.91) v1(33.45,68.23) v1(33.45,67.14) v1(33.45,65.88) v1(33.45,64.63) v1(33.5,62.3) v1(33.5,59.78) v1(33.83,63.14) v1(33.88,24.76) v1(33.88,23.07) v1(34,64.06) v1(34.06,61.7) v1(34.32,62.53) v1(34.32,60.84) v1(34.34,65.84) v1(34.42,25.62) v1(34.58,24.04) v1(34.7,69.91) v1(34.7,68.23) v1(34.92,2.65) v1(34.92,0.97) v1(35.09,64.82) v1(35.09,63.14) v1(35.03,61.77) v1(35.19,22.92) v1(35.31,24.76) v1(35.49,25.93) v1(35.58,62.53) v1(35.58,60.84) v1(35.74,64.27) v1(36.04,21.21) v1(36.21,24.45) v1(36.21,23.28) v1(36.19,8.87) v1(36.19,7.19) v1(36.17,2.65) v1(36.17,0.97) v1(36.34,64.82) v1(36.34,63.14) v1(36.42,43.86) v1(36.42,42.17) v1(36.61,63.81) v1(36.99,50.62) v1(37.16,16.26) v1(37.32,63.5) v1(37.48,32.25) v1(37.45,8.87) v1(37.45,7.19) v1(37.43,2.65) v1(37.43,0.97) v1(37.68,43.86) v1(37.68,42.17) v1(37.64,15.77) v1(38.09,62.99) v1(38.25,50.62) v1(38.47,33.48) v1(38.49,20.08) v1(38.5,16.62) v1(38.49,14.73) v1(38.71,8.87) v1(38.71,7.19) v1(38.69,2.65) v1(38.69,0.97) v1(38.98,34.4) v1(39.1,6.27) v1(39.1,4.59) v1(39.18,30.11) v1(39.18,28.43) v1(39.44,50.26) v1(39.73,35.16) v1(39.87,3.46) v1(39.87,1.78) v1(40,30.98) v1(40,29.3) v1(39.96,8.87) v1(39.96,7.19) v1(40.22,9.74) v1(40.22,8.06) v1(40.37,19.01) v1(40.36,6.27) v1(40.36,4.59) v1(40.44,30.11) v1(40.44,28.43) v1(41.09,17.94) v1(41.12,3.46) v1(41.12,1.78) v1(41.26,30.98) v1(41.26,29.3) v1(41.24,18.91) v1(41.48,9.74) v1(41.48,8.06) v1(41.61,6.27) v1(41.61,4.59) v1(41.66,50.21) v1(42.1,17.28) v1(42.21,18.2) v1(42.24,26.8) v1(42.38,3.46) v1(42.38,1.78) v1(42.65,44.24) v1(42.65,42.56) v1(42.74,9.74) v1(42.74,8.06) v1(42.87,6.27) v1(42.87,4.59) v1(43.64,3.46) v1(43.64,1.78) v1(43.91,44.24) v1(43.91,42.56) v1(43.99,9.74) v1(43.99,8.06) v1(45.07,27.12) v1(45.27,28.81) v1(45.32,27.89) v1(46.41,4.82) v1(46.41,3.29) v1(46.41,1.6) v1(47.36,63.95) v1(47.36,62.27) v1(47.67,4.82) v1(47.67,3.29) v1(47.67,1.6) v1(48.48,56.86) v1(48.48,55.18) v1(48.62,63.95) v1(48.62,62.27) v1(48.92,4.82) v1(48.92,3.29) v1(48.92,1.6) v1(49.35,61.2) v1(49.35,59.52) v1(49.74,56.86) v1(49.74,55.18) v1(49.88,63.95) v1(49.88,62.27) v1(50.18,4.82) v1(50.18,3.29) v1(50.18,1.6) v1(50.32,49.21) v1(50.32,47.53) v1(50.61,61.2) v1(50.61,59.52) v1(50.54,31.19) v1(50.54,29.66) v1(50.54,27.98) v1(50.68,53.65) v1(50.68,51.97) v1(51,56.86) v1(51,55.18) v1(51.13,63.95) v1(51.13,62.27) v1(51.58,49.21) v1(51.58,47.53) v1(51.8,31.19) v1(51.8,29.66) v1(51.8,27.98) v1(51.87,61.2) v1(51.87,59.52) v1(51.93,53.65) v1(51.93,51.97) v1(52.12,13.74) v1(52.12,12.21) v1(52.12,10.53) v1(52.26,56.86) v1(52.26,55.18) v1(52.83,49.21) v1(52.83,47.53) v1(53.12,61.2) v1(53.12,59.52) v1(53.06,31.19) v1(53.06,29.66) v1(53.06,27.98) v1(53.19,53.65) v1(53.19,51.97) v1(53.38,13.74) v1(53.38,12.21) v1(53.38,10.53) v1(53.74,58.14) v1(53.74,56.46) v1(54.09,49.21) v1(54.09,47.53) v1(54.32,31.19) v1(54.32,29.66) v1(54.32,27.98) v1(54.45,53.65) v1(54.45,51.97) v1(54.64,13.74) v1(54.64,12.21) v1(54.64,10.53) v1(54.99,58.14) v1(54.99,56.46) v1(55.74,51.64) v1(55.74,50.11) v1(55.74,48.42) v1(55.89,35.98) v1(55.89,34.45) v1(55.89,32.76) v1(55.89,13.74) v1(55.89,12.21) v1(55.89,10.53) v1(56.15,45.72) v1(56.15,44.19) v1(56.15,42.51) v1(56.25,58.14) v1(56.25,56.46) v1(56.35,40.72) v1(56.35,39.19) v1(56.35,37.51) v1(57,51.64) v1(57,50.11) v1(57,48.42) v1(57.15,35.98) v1(57.15,34.45) v1(57.15,32.76) v1(57.23,13.13) v1(57.23,11.6) v1(57.41,45.72) v1(57.41,44.19) v1(57.41,42.51) v1(57.4,15.12) v1(57.51,58.14) v1(57.51,56.46) v1(57.61,40.72) v1(57.61,39.19) v1(57.61,37.51) v1(57.53,19.82) v1(58.01,30.68) v1(58.01,29.42) v1(58.01,28.16) v1(58.01,26.9) v1(58.01,25.68) v1(58.01,24.42) v1(58.01,23.16) v1(58.01,21.9) v1(58.26,51.64) v1(58.26,50.11) v1(58.26,48.42) v1(58.41,35.98) v1(58.41,34.45) v1(58.41,32.76) v1(58.48,13.13) v1(58.48,11.6) v1(58.66,45.72) v1(58.66,44.19) v1(58.66,42.51) v1(58.87,40.72) v1(58.87,39.19) v1(58.87,37.51) v1(58.99,21.09) v1(59.51,51.64) v1(59.51,50.11) v1(59.51,48.42) v1(59.54,30.68) v1(59.54,29.42) v1(59.54,28.16) v1(59.54,26.9) v1(59.54,25.68) v1(59.54,24.42) v1(59.54,23.16) v1(59.54,21.9) v1(59.67,35.98) v1(59.67,34.45) v1(59.67,32.76) v1(59.74,13.13) v1(59.74,11.6) v1(59.92,45.72) v1(59.92,44.19) v1(59.92,42.51) v1(60.13,40.72) v1(60.13,39.19) v1(60.13,37.51) v1(61,13.13) v1(61,11.6) v1(61.22,30.68) v1(61.22,29.42) v1(61.22,28.16) v1(61.22,26.9) v1(61.22,25.68) v1(61.22,24.42) v1(61.22,23.16) v1(61.22,21.9) v1(61.2,14.72)
VIN_24V: length 20.1
  Top Layer w0.5: R1.2 16.34,52.97
  Top Layer w1.5: 16.62,53.25 C2.1 ; 16.62,53.25 17.77,54.4 U1.1 23.76,50.95 ; 16.62,53.25 D2.2
BLK: length 19.4
  Top Layer w0.3: U3.14 32.28,17.05 27.52,12.29 v1(25.79,12.29)
  Bottom Layer w0.3: v1(25.79,12.29) 25.79,5.69 H2.5
BOOT0: length 4.4
  Top Layer w0.3: U3.44 33.78,31.75 33.74,31.79 R4.2
BOOT1: length 5.8
  Top Layer w0.3: U3.20 35.28,14.84 35.43,14.69 R5.2
CS: length 19.2
  Top Layer w0.3: H7.6 16.76,16.13 25.6,16.13 27.32,17.85 27.32,20.09 28.42,21.2 U3.12
DC: length 19.5
  Top Layer w0.3: H7.5 29.13,15.23 31.78,17.88 U3.13
MISO: length 20.1
  Top Layer w0.3: U3.16 v1(33.28,21.37)
  Bottom Layer w0.3: H2.3 33.28,8.11 v1(33.28,21.37)
NRST: length 8
  Top Layer w0.3: C13.2 22.96,22.31 R6.2 24.92,22.31 26.31,23.7 U3.7
PA0: length 21.2
  Top Layer w0.3: U3.10 v1(31.75,22.2)
  Bottom Layer w0.3: H2.4 27.12,17.57 v1(31.75,22.2)
PA11: length 11.9
  Top Layer w0.3: U3.32 44.49,24.7 v1(44.61,24.58)
  Bottom Layer w0.3: H3.5 44.61,23.81 v1(44.61,24.58)
PA12: length 10.6
  Top Layer w0.3: v1(45.88,24.84) 45.52,25.2 U3.33
  Bottom Layer w0.3: v1(45.88,24.84) 48.13,22.59 H3.4
PA15: length 14.6
  Top Layer w0.3: v1(36.45,26.11) 36.78,26.45 U3.38
  Bottom Layer w0.3: v1(36.45,26.11) 47.38,26.11 H3.3
PB0: length 16
  Top Layer w0.3: H2.2 33.54,5.82 33.54,14.64 34.28,15.38 U3.18
PB1: length 15.7
  Top Layer w0.3: H2.1 34.74,5.64 34.1,6.28 34.1,14.43 34.78,15.12 U3.19
PB3: length 14.1
  Top Layer w0.3: H4.5 36.28,34.17 U3.39
PB4: length 13.3
  Top Layer w0.3: U3.40 35.78,36.21 H4.4
PB5: length 12.4
  Top Layer w0.3: H4.3 35.28,38.25 U3.41
PB6: length 17.7
  Top Layer w0.3: U3.42 34.78,39.66 H4.2 34.47,44.3 35.53,45.36 D7.2
PB7: length 15.8
  Top Layer w0.3: U3.43 v1(34.28,26.67) ; v1(34,35.5) 34,37.9 H4.1
  Bottom Layer w0.3: v1(34.28,26.67) 34.28,35.21 v1(34,35.5)
PB8: length 18.3
  Top Layer w0.3: v1(28.08,29.94) v1(28.08,36.31) ; U3.45 v1(33.28,26.67)
  Bottom Layer w0.3: H5.5 28.08,39.63 v1(28.08,36.31) ; v1(28.08,29.94) 31.35,26.67 v1(33.28,26.67)
PB9: length 16.9
  Top Layer w0.3: v1(28.95,30.55) 28.95,36.9 H5.4 ; v1(32.88,30.45) 32.78,30.35 U3.46
  Bottom Layer w0.3: v1(32.88,30.45) 32.77,30.55 v1(28.95,30.55)
PB12: length 19.6
  Top Layer w0.3: H6.5 43.33,11.87 43.33,18.92 41.05,21.2 U3.25
PB13: length 18
  Top Layer w0.3: H6.4 44.35,13.39 44.35,19.07 41.73,21.7 U3.26
PB14: length 16.2
  Top Layer w0.3: U3.27 42.15,22.2 45.27,19.07 45.27,15.02 H6.3
PC13: length 17.6
  Top Layer w0.3: U3.2 28.61,26.2 25.63,29.17 25.63,37.68 H5.3
PC14: length 19.5
  Top Layer w0.3: U3.3 27.99,25.7 24.82,28.87 24.82,35.95 H5.2
PC15: length 21.3
  Top Layer w0.3: H5.1 24,34.23 24,28.82 27.62,25.2 U3.4
RES: length 19.7
  Top Layer w0.3: H7.7 18.55,16.88 25.38,16.88 26.6,18.11 26.6,20.09 28.21,21.7 U3.11
RST: length 14.4
  Top Layer w0.3: H6.2 46.44,16.38 46.44,18.82 42.56,22.7 U3.28
RXD: length 19
  Top Layer w0.3: P4.2 52.97,23.87 43.61,23.87 43.28,24.2 U3.31
RXD3: length 30.7
  Top Layer w0.3: v1(42.16,12.85) 42.12,12.89 R7.1 38.13,13.97 36.28,15.82 U3.22
  Bottom Layer w0.3: v1(42.16,12.85) 42.57,13.26 50.01,13.26 53.94,17.19 P2.2
SCL: length 25.2
  Top Layer w0.3: U3.15 32.78,15.87 v1(32.26,15.35) ; H7.3 29.46,10.15 v1(32.26,12.95)
  Bottom Layer w0.3: v1(32.26,12.95) v1(32.26,15.35)
SDA: length 24.7
  Top Layer w0.3: U3.17 33.78,15.85 29.53,11.59 24.1,11.59 23.01,12.69 H7.4
SPINDLE_PWM: length 12.5
  Top Layer w0.3: U3.29 42.78,23.2 47.21,18.76 47.21,18.15 H6.1
SWCLK: length 20.3
  Top Layer w0.3: v1(38.74,31.26) 38.69,31.26 37.28,29.86 U3.37
  Bottom Layer w0.3: v1(38.74,31.26) 42.36,34.88 51.98,34.88 P3.3
SWDIO: length 20.3
  Top Layer w0.3: P3.4 48.45,33.68 46.29,31.52 46.29,27.29 44.7,25.7 U3.34
TXD: length 19.8
  Top Layer w0.3: U3.30 43.14,23.7 45.47,21.37 53.01,21.37 P4.3
TXD3: length 31.7
  Top Layer w0.3: U3.21 35.78,15.56 38.38,12.95 v1(39.91,12.95)
  Bottom Layer w0.3: P2.3 59.25,19.73 58.09,18.56 45.52,18.56 v1(39.91,12.95)
VUSB: length 6.8
  Top Layer w1.2: 41.71,64.82 41.71,58.67 D1.1
XTAL1: length 23.9
  Top Layer w0.3: U3.5 24.1,24.7 21.91,26.89 21.91,32.34 18.9,35.35 Y1.1 17.85,36.07 17.38,35.6 C9.1
XTAL2: length 16.4
  Top Layer w0.3: U3.6 23.37,24.2 21.51,26.07 Y1.2 17.85,26.07 17.17,26.75 C8.1
$1N53807: length 2
  Top Layer w0.3: R3.1 37.3,45.34 D7.1
$1N55881: length 2.1
  Top Layer w0.3: D6.1 37.26,47.63 R2.2
$1N62733: length 1.9
  Top Layer w0.5: D4.1 11.66,49.56 R1.1

## Copper pours and planes (outline as drawn; the poured copper is in the pictures)
SGND on Top Layer: -2.47,73.96 64.65,73.96 64.65,-1.42 -2.47,-1.42
SGND on Bottom Layer: -1.86,74.06 64.29,74.06 64.29,-1.73 -1.86,-1.73

Small or netless copper shapes (teardrops, artwork), in the pictures only: 114 on Top Layer, 29 on Bottom Layer

## Text on the board
Top Silkscreen Layer: RES | CS | DC | SDA | SCL | GND | 3V3 | 5V | CLK | DIO | TX | RX
